# Altium schematic sheet SH01 - TITLE PAGE.SchDoc
size 386 x 246 mm
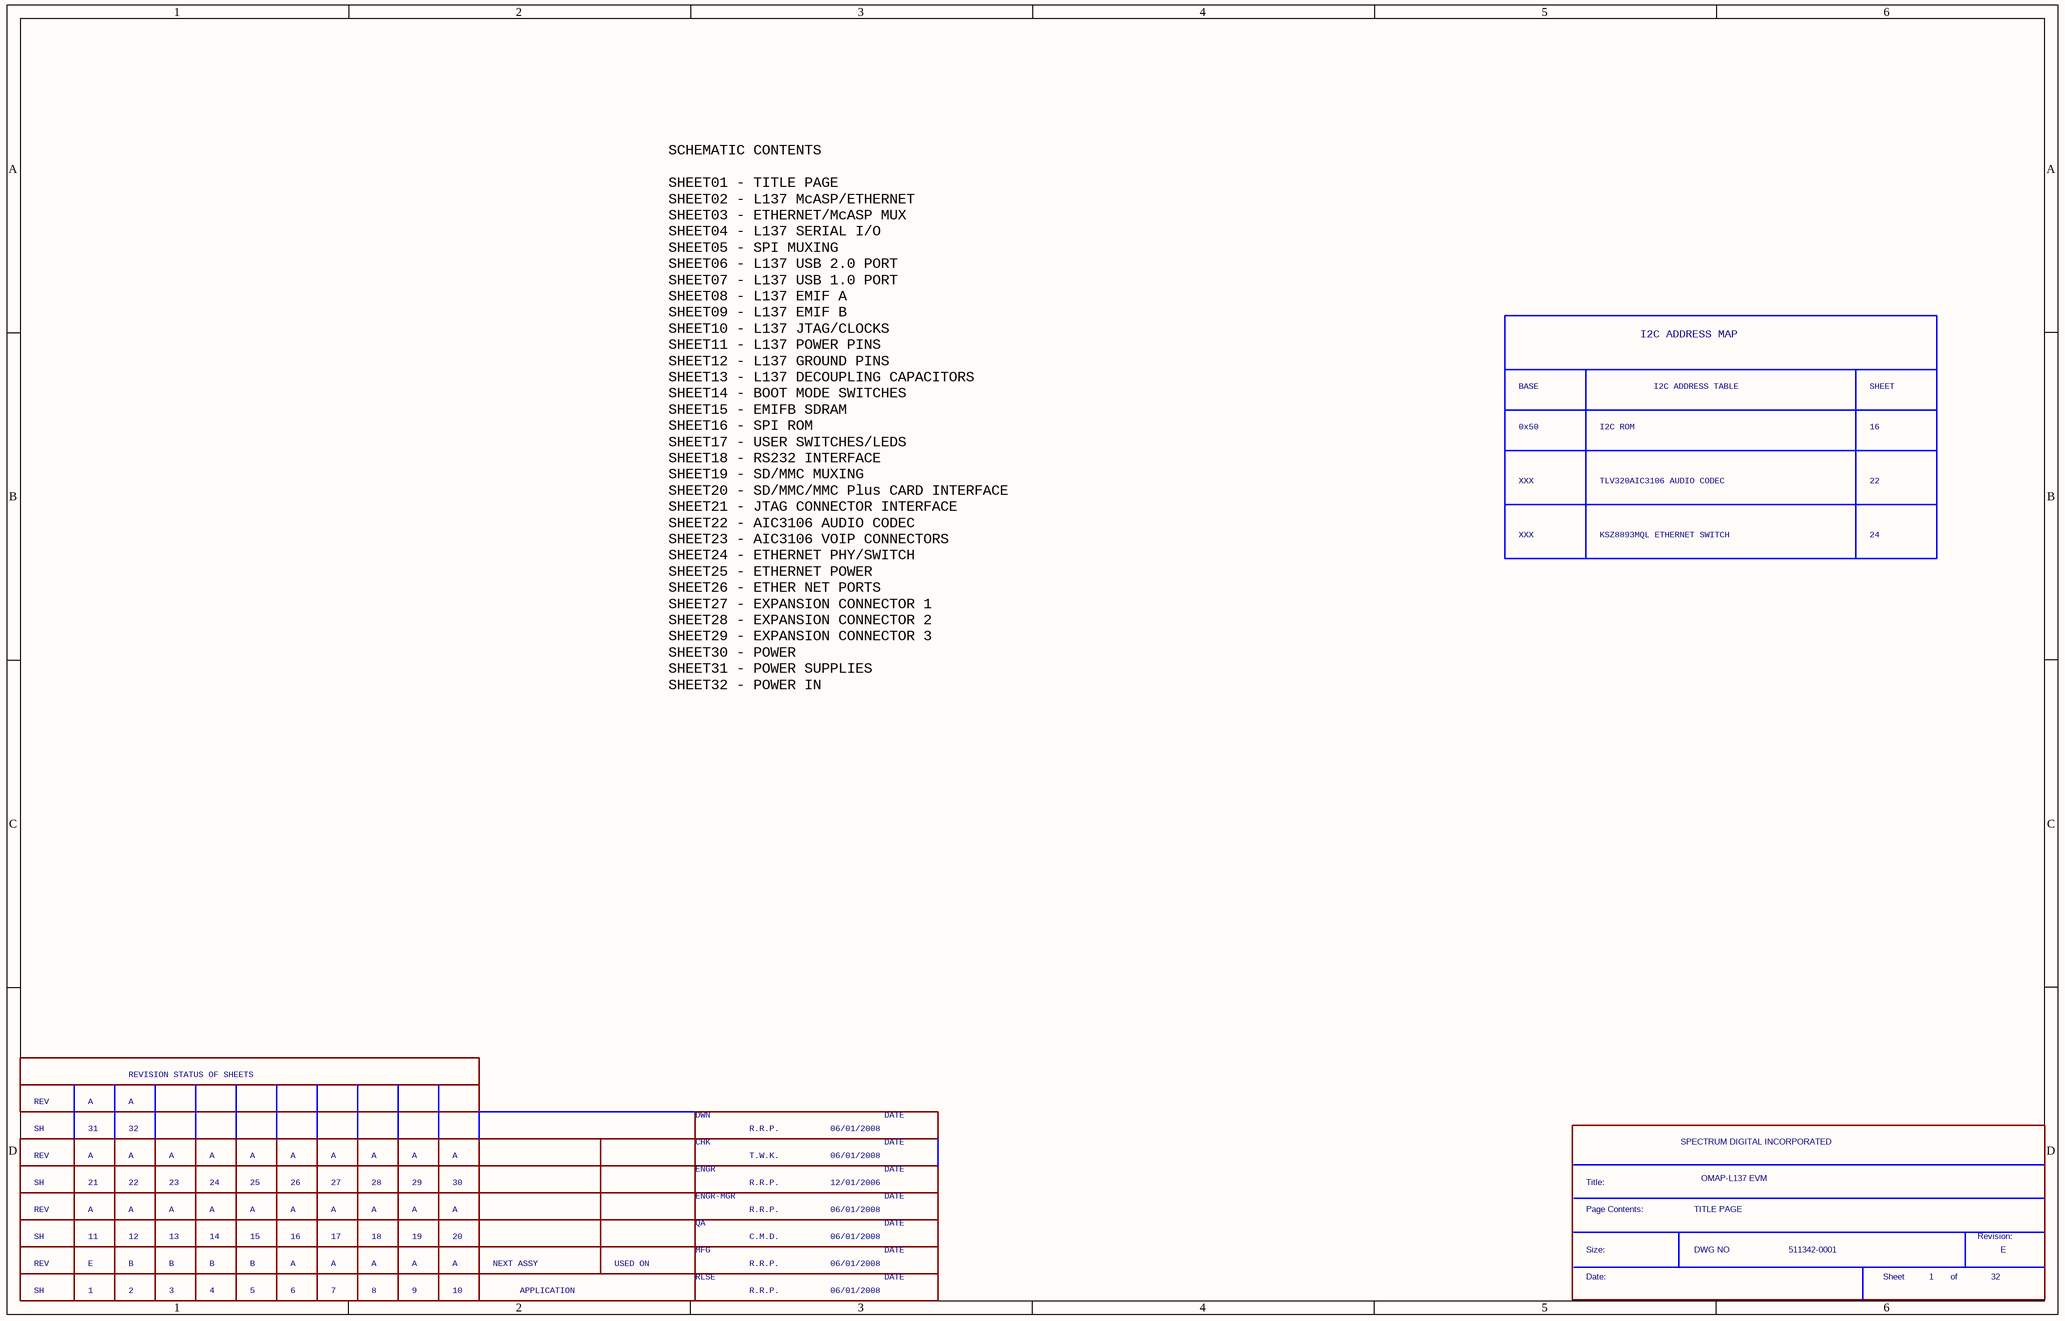
[diagram p0: SH01 - TITLE PAGE.SchDoc]

## Parts
*  Page Contents:: TITLE PAGE  RevCode: E  Title: OMAP-L137 EVM  OrgName: SPECTRUM DIGITAL INCORPORATED  Doc: 511342-0001  Page Number: 1  Page Count: 32  (hidden comment: SDTitleBlock)  (graphical)

## Notes on the sheet
- SCHEMATIC CONTENTS
  SHEET01 - TITLE PAGE
  SHEET02 - L137 McASP/ETHERNET
  SHEET03 - ETHERNET/McASP MUX
  SHEET04 - L137 SERIAL I/O
  SHEET05 - SPI MUXING
  SHEET06 - L137 USB 2.0 PORT
  SHEET07 - L137 USB 1.0 PORT
  SHEET08 - L137 EMIF A
  SHEET09 - L137 EMIF B
  SHEET10 - L137 JTAG/CLOCKS
  SHEET11 - L137 POWER PINS
  SHEET12 - L137 GROUND PINS
  SHEET13 - L137 DECOUPLING CAPACITORS
  SHEET14 - BOOT MODE SWITCHES
  SHEET15 - EMIFB SDRAM
  SHEET16 - SPI ROM
  SHEET17 - USER SWITCHES/LEDS
  SHEET18 - RS232 INTERFACE
  SHEET19 - SD/MMC MUXING
  SHEET20 - SD/MMC/MMC Plus CARD INTERFACE
  SHEET21 - JTAG CONNECTOR INTERFACE
  SHEET22 - AIC3106 AUDIO CODEC
  SHEET23 - AIC3106 VOIP CONNECTORS
  SHEET24 - ETHERNET PHY/SWITCH
  SHEET25 - ETHERNET POWER
  SHEET26 - ETHER NET PORTS
  SHEET27 - EXPANSION CONNECTOR 1
  SHEET28 - EXPANSION CONNECTOR 2
  SHEET29 - EXPANSION CONNECTOR 3
  SHEET30 - POWER
  SHEET31 - POWER SUPPLIES
  SHEET32 - POWER IN
- BASE
- I2C ADDRESS MAP
- I2C ADDRESS TABLE
- SHEET
- 0x50
- I2C ROM
- 16
- XXX
- TLV320AIC3106 AUDIO CODEC
- 22
- KSZ8893MQL ETHERNET SWITCH
- 24
- REV
- SH
- 31
- A
- REVISION STATUS OF SHEETS
- 32
- DWN
- R.R.P.
- 06/01/2008
- DATE
- 21
- 23
- 25
- 26
- 27
- 28
- 29
- 30
- ENGR
- ENGR-MGR
- CHK
- T.W.K.
- 12/01/2006
- 11
- E
- 12
- B
- 13
- 14
- 15
- 17
- 18
- 19
- 20
- NEXT ASSY
- USED ON
- MFG
- QA
- C.M.D.
- 1
- 2
- 3
- 4
- 5
- 6
- 7
- 8
- 9
- 10
- APPLICATION
- RLSE
- (in symbol SDTitleBlock) Title:; Page Contents:; Revision:; Size:; DWG NO; Date:; Sheet; of